# Altium schematic sheet Sheet1.SchDoc
size A3; SheetNumber: 1; SheetTotal: 2
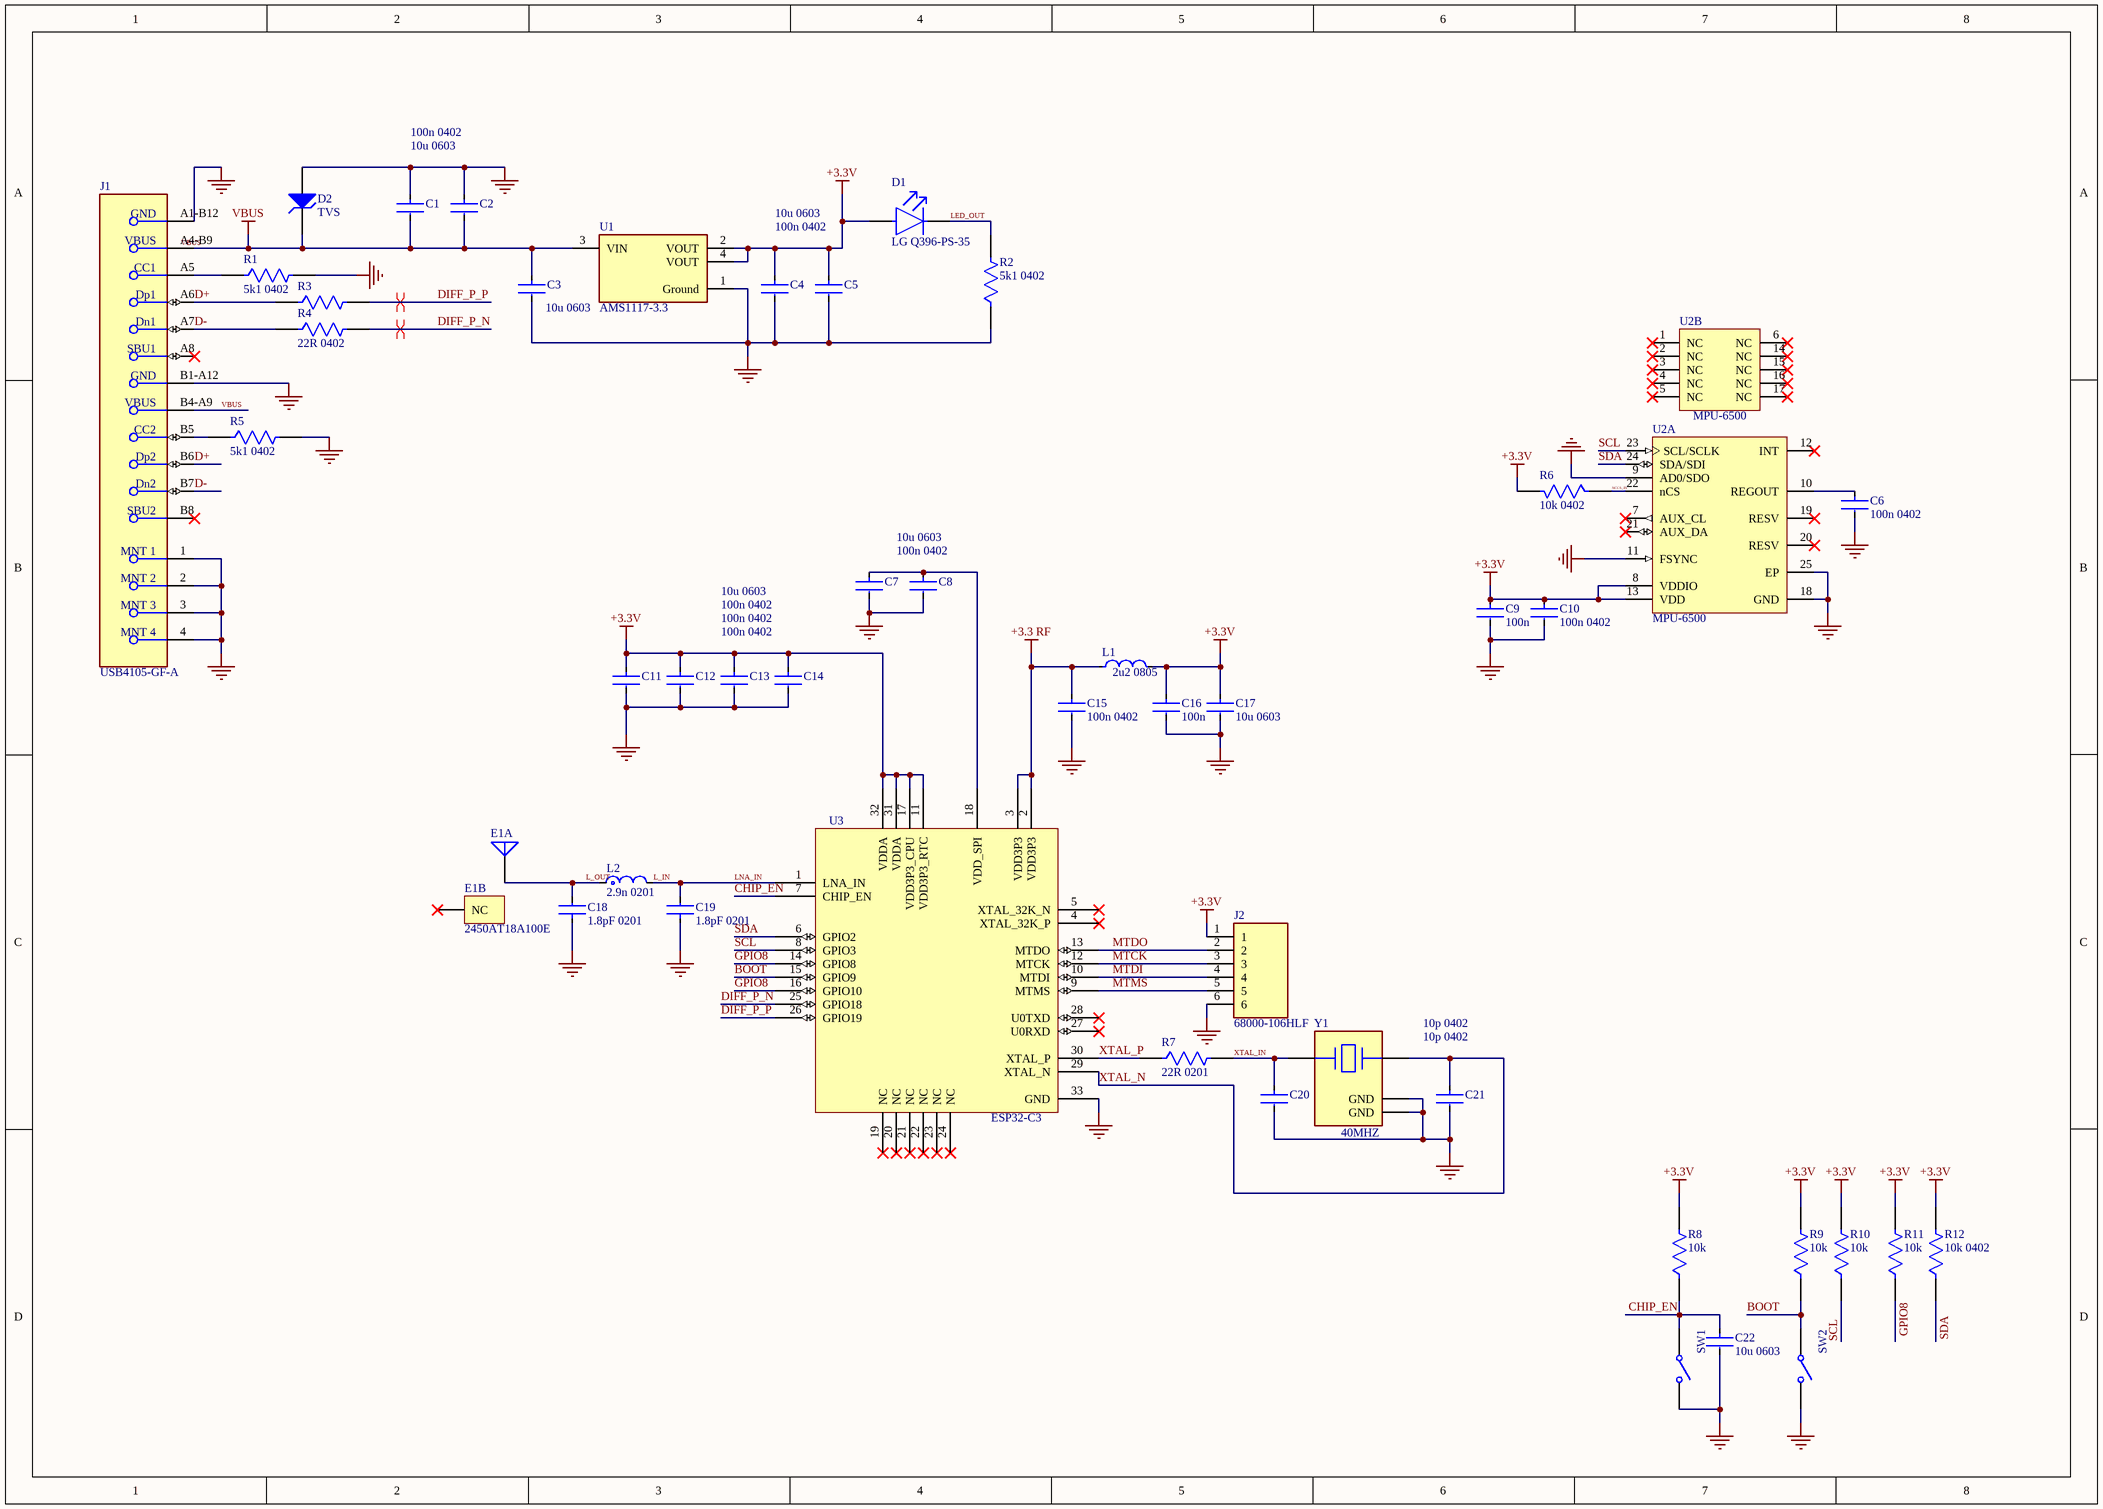
[diagram p0: Sheet1.SchDoc]

## Parts
C1  100n 0402  [FP-0402B104K500CT-IPC_C]
C2  10u 0603  [FP-GRM188-0_15-IPC_C]
C3  10u 0603  [FP-GRM188-0_15-IPC_C]
C4  10u 0603  [FP-GRM188-0_15-IPC_C]
C5  100n 0402  [FP-0402B104K500CT-IPC_C]
C6  100n 0402  [FP-0402B104K500CT-IPC_C]
C7  10u 0603  [FP-GRM188-0_15-IPC_C]
C8  100n 0402  [FP-0402B104K500CT-IPC_C]
C9  100n  [FP-0402B104K500CT-IPC_C]
C10  100n 0402  [FP-0402B104K500CT-IPC_C]
C11  10u 0603  [FP-GRM188-0_15-IPC_C]
C12  100n 0402  [FP-0402B104K500CT-IPC_C]
C13  100n 0402  [FP-0402B104K500CT-IPC_C]
C14  100n 0402  [FP-0402B104K500CT-IPC_C]
C15  100n 0402  [FP-0402B104K500CT-IPC_C]
C16  100n  [FP-0402B104K500CT-IPC_C]
C17  10u 0603  [FP-GRM188-0_15-IPC_C]
C18  1.8pF 0201  [FP-GRM033-0_03-IPC_B]
C19  1.8pF 0201  [FP-GRM033-0_03-IPC_B]
C20  10p 0402  [FP-C0402-BB-MFG]
C21  10p 0402  [FP-C0402-BB-MFG]
C22  10u 0603  [FP-GRM188-0_15-IPC_C]
D1  LG Q396-PS-35  [FP-LG_Q396-MFG]
D2  TVS  [ONSC-SOD-523-2-502-01_V]
E1  2450AT18A100E  [JT-2450AT18A100-2_V]  (value not drawn)  (parts A,B of 2)
J1  USB4105-GF-A  [FP-USB4105-GF-A-MFG]
J2  68000-106HLF  [HDRV6W64P0X254_1X6_1524X254X839P]
L1  2u2 0805  [FP-MLZ2012-0_85-IPC_B]
L2  2.9n 0201  [FP-LQP03TG_02-IPC_B]
R1  5k1 0402  [FP-RN73R1E-IPC_C]
R2  5k1 0402  [FP-RN73R1E-IPC_C]
R3  22R 0402  [FP-MCR01-IPC_C]  (value not drawn)
R4  22R 0402  [FP-MCR01-IPC_C]
R5  5k1 0402  [FP-RN73R1E-IPC_C]
R6  10k 0402  [FP-MCS0402-IPC_C]
R7  22R 0201  [FP-AF0201-IPC_A]
R8  10k  [FP-MCS0402-IPC_C]
R9  10k  [FP-MCS0402-IPC_C]
R10  10k  [FP-MCS0402-IPC_C]
R11  10k  [FP-MCS0402-IPC_C]
R12  10k 0402  [FP-MCS0402-IPC_C]
SW1  434121025816  [434121025816]  (value not drawn)
SW2  434121025816  [434121025816]  (value not drawn)
U1  AMS1117-3.3  [FP-AMS1117-IPC_C]
U2  MPU-6500  [INSE-MPU-6500-QFN24_M]  (parts A,B of 2)
U3  ESP32-C3  [ESP32-C3 - duplicate2]
Y1  40MHZ  [FP-ABM3B-MFG]

## Nets
+3.3 RF: C15.1 L1.1 U3.2(VDD3P3) U3.3(VDD3P3)
+3.3V: C4.1 C5.1 C9.1 C10.1 C11.1 C12.1 C13.1 C14.1 C16.1 C17.1 D1.2(A) J2.1 L1.2 R6.2 R8.2 R9.2 R10.2 R11.2 R12.2 U1.2(VOUT) U1.4(VOUT) U2.8(VDDIO) U2.13(VDD) U3.11(VDD3P3_RTC) U3.17(VDD3P3_CPU) U3.31(VDDA) U3.32(VDDA)
GND: C1.1 C2.1 C3.2 C4.2 C5.2 C6.2 C7.2 C8.2 C9.2 C10.2 C11.2 C12.2 C13.2 C14.2 C15.2 C16.2 C17.2 C18.1 C19.1 C20.2 C21.2 C22.2 D2.2(A) J1.1(MNT_1) J1.2(MNT_2) J1.3(MNT_3) J1.4(MNT_4) J1.A1-B12(GND) J1.B1-A12(GND) J2.6 R1.2 R2.1 R5.2 SW1.2 SW2.2 U1.1(Ground) U2.9(AD0/SDO) U2.11(FSYNC) U2.18(GND) U2.25(EP) U3.33(GND) Y1.2(GND) Y1.4(GND)
VBUS: C1.2 C2.2 C3.1 D2.1(K) J1.A4-B9(VBUS) J1.B4-A9(VBUS) U1.3(VIN)
BOOT: R9.1 SW2.1 U3.15(GPIO9)
CHIP_EN: C22.1 R8.1 SW1.1 U3.7(CHIP_EN)
D+: J1.A6(Dp1) J1.B6(Dp2) R3.1
D-: J1.A7(Dn1) J1.B7(Dn2) R4.1
DIFF_P_N: R4.2 U3.25(GPIO18)
DIFF_P_P: R3.2 U3.26(GPIO19)
GPIO8: R11.1 U3.14(GPIO8) U3.16(GPIO10)
L_IN: C19.2 L2.2 U3.1(LNA_IN)  [also labelled LNA_IN]
L_OUT: C18.2 E1.1(FP) L2.1
LED_OUT: D1.1(C) R2.2
MTCK: J2.3 U3.12(MTCK)
MTDI: J2.4 U3.10(MTDI)
MTDO: J2.2 U3.13(MTDO)
MTMS: J2.5 U3.9(MTMS)
NCCS_IN: R6.1 U2.22(nCS)
SCL: R10.1 U2.23(SCL/SCLK) U3.8(GPIO3)
SDA: R12.1 U2.24(SDA/SDI) U3.6(GPIO2)
XTAL_IN: C20.1 R7.2 Y1.1
XTAL_N: C21.1 U3.29(XTAL_N) Y1.3
XTAL_P: R7.1 U3.30(XTAL_P)
NetC6_1: C6.1 U2.10(REGOUT)
NetC7_1: C7.1 C8.1 U3.18(VDD_SPI)
NetJ1_A5: J1.A5(CC1) R1.1
NetJ1_B5: J1.B5(CC2) R5.1

Not connected (* = marked no-connect by the designer): E1 2(NC)*; J1 A8(SBU1)* B8(SBU2)*; U2 1(NC)* 2(NC)* 3(NC)* 4(NC)* 5(NC)* 6(NC)* 7(AUX_CL)* 12(INT)* 14(NC)* 15(NC)* 16(NC)* 17(NC)* 19(RESV)* 20(RESV)* 21(AUX_DA)*; U3 4(XTAL_32K_P)* 5(XTAL_32K_N)* 19(NC)* 20(NC)* 21(NC)* 22(NC)* 23(NC)* 24(NC)* 27(U0RXD)* 28(U0TXD)*

## Layout directives
differential pair: DIFF_P_N, DIFF_P_P

## Notes on the sheet
- Labels drawn without touching a wire or pin: VBUS

## Library data of the parts
C1 C5 C6 C8-C10 C12-C16 = CMP-45632-000010-1: CAP CER 0.1UF 50V X7R 0402; Tolerance: 10%; Capacitance: 100nF; Max Operating Temperature: 125°C; Case Code (Metric): 1005; RoHS Compliant: Yes; Series: -; Case Code (Imperial): 0402; Voltage Rating: 50V; Min Operating Temperature: -55°C; Mount: Surface Mount; Case/Package: 0402; Packaging: Cut Tape
C2-C4 C7 C11 C17 C22 = CMP-06035-017494-1: Chip Multilayer Ceramic Capacitors for General Purpose, 0603, 10uF, X5R, 15%, 20%, 16V; Thickness: 0.037inch; Case/Package: 0603; Case Code (Metric): 1608; Voltage Rating: 16V; Tolerance: 20%; Min Operating Temperature: -55°C; Capacitance: 10uF; Length: 0.063inch; Case Code (Imperial): 0603; Packaging: Cut Tape; Lead Free: Lead Free; Material: Ceramic; Height: 0.8mm; Max Operating Temperature: 85°C; Mount: Surface Mount; Width: 0.031inch; Voltage Rating (DC): 16V
C18 C19 = CMP-2010-01087-2: Chip Multilayer Ceramic Capacitors for General Purpose, 0201, 1.8pF, C0G, 30ppm/°C, 0.1pF, 50V; Width: 0.012inch; Voltage Rating (DC): 50V; Max Operating Temperature: 125°C; Capacitance: 1.8pF; Min Operating Temperature: -55°C; Case Code (Imperial): 0201; Packaging: Tape and Reel; Termination: SMD/SMT; Voltage Rating: 50V; Case/Package: 0201; Case Code (Metric): 0603; Length: 0.6mm; Thickness: 0.013inch; Depth: 0.3mm; Package Quantity: 15000; Mount: Surface Mount; Height: 0.3mm; Dielectric: C0G
C20 C21 = CMP-03020-005426-2: CAP CER 10PF 16V NP0 0402; Manufacturer Part Number: C0402C100J4GAC7867; Manufacturer: Kemet; Temperature Characteristic: C0G; Temperature Coefficient: 15%; Tolerance: 0.05; Material: Ceramic; Octopart: https://octopart.com/c0402c100j4gac7867-kemet-1500972; Package: C0402-BB; Ipc Land Pattern Name: CAPC10050X50; Temperature Range Low: -55°C; ComponentLink2URL: https://content.kemet.com/datasheets/KEM_C1002_X7R_SMD.pdf; ComponentLink2Description: Datasheet; Device Class L2: Capacitors; Lead Free: Yes; Temperature Range High: +125°C; Device Class L1: Passive Components; Automotive: No; Category: Cap; Height: 0.55mm; Capacitance: 10 pF; Digikey Description: CAP CER 10PF 16V NP0 0402; Device Class L3: Ceramic Capacitors; Value: 10 pF; Voltage Rating: 16 V; Temperature: -55°C to +125°C; RoHS: TRUE
D1 = CMP-62016-000069-1: LED GREEN DIFFUSED 0603 SMD; Lens Color: White; Wavelength: 573nm; Test Current: 20mA; Luminous Intensity: 163mcd; Lens Style: Flat; Lens Size: 0.8mm; Forward Voltage: 2V; Viewing Angle: 120°; Height: 0.4mm; Color: Green; Mount: Surface Mount; Case Code (Metric): 1608; Lens Transparency: Diffused; REACH SVHC: No SVHC; Length: 1.6mm; Width: 0.8mm; Dominant Wavelength: 573nm; RoHS Compliant: Yes; Case/Package: 0603; Case Code (Imperial): 0603; Packaging: Tape and Reel; Forward Current: 20mA
D2 = CMP-1063-00102-1: Transient Voltage Suppressor, Micro-Packaged Diode for ESD Protection, 2-Pin SOD-523, Pb-Free, Tape and Reel; Manufacturer: On Semiconductor; PartNumber: ESD5Z5.0T1G; V(BR) Min (V): 6.2; VRWM Max (V): 5; Number of Lines: 1; PPK Max (W): 174; IR Max (uA): 0.05; Direction: Unidirectional; PackageVersion: Rev. E, 09/2010; Mounting Technology: Surface Mount; Packing: Tape and Reel; ComponentLink2URL: http://www.onsemi.cn/pub_link/Collateral/ESD5Z2.5T1-D.PDF; ComponentLink2Description: Datasheet; PackageReference: SOD-523-2-502-01; ComponentLink1Description: Manufacturer URL; ComponentLink3URL: http://www.onsemi.com/pub_link/Collateral/502-01.PDF; PackageDescription: 2-Pin SOD, Body 1.2 x 0.8 mm; ComponentLink3Description: Package Specification; ComponentLink1URL: http://www.onsemi.com/; RoHS: Pb-Free; DatasheetVersion: Rev. 10
E1 = CMP-2000-05167-1: Ceramic Antenna, 2.45 GHZ, 2 W, -40 to 125 degC, 2-Pin SMD, RoHS, Tape and Reel; Manufacturer: Johanson Technology; Maximum Frequency: 2500MHz; Typical Antenna Gain: 0.5dB; Minimum Frequency: 2400MHz; Manufacturer URL: https://www.johansontechnology.com/; Type: Ceramic; Datasheet Version: Rev. 1.3, 07/2014; Category: Antenna; Package: 2Case18-4; Datasheet URL: http://www.johansontechnology.com/datasheets/antennas/2450AT18A100.pdf
J1 = e7c17a616881a82b79941196b4bec10: CONN RCPT USB2.0 TYPEC 5A; Manufacturer: GCT; Voltage Rating: 20V; Is Female: yes; Current Rating: 5/6.25/1.25/0.25A; Number Of Contacts: 16; Conn Orientation: Right Angle; Device Class L1: Connectors; Category: Conn; Lead Free: Yes; RoHS: TRUE; Temperature Range High: +85°C; Digikey Description: CONN RCPT USB2.0 TYPEC 5A; Device Class L3: unset; ComponentLink2Description: Datasheet; Manufacturer Part Number: USB4105-GF-A; Package: 0; Usb Standard: USB 2.0; Device Class L2: USB Connectors; Automotive: No; Temperature Range Low: -40°C; Height: 3.46mm; Temperature: -40°C to +85°C; Contact Material: Gold,Nickel; ComponentLink2URL: https://gct.co/files/drawings/usb4105.pdf; Octopart: https://octopart.com/usb4105-gf-a-gct-106627878
J2 = 68000-106HLF: Headers & Wire Housings 6POS HDR 30AU; Manufacturer_Name: Amphenol; Geometry.Height: 8.39mm; Manufacturer_Part_Number: 68000-106HLF; Mouser Part Number: 649-68000-106HLF; Mouser Price/Stock: https://www.mouser.co.uk/ProductDetail/Amphenol-FCI/68000-106HLF?qs=osVJq4lsVJd8cfhpTPyS9w%3D%3D; Arrow Part Number: *; Arrow Price/Stock: *; Datasheet Link: https://cdn.amphenol-cs.com/media/wysiwyg/files/drawing/68000.pdf
L1 = CMP-08253-000223-1: Shielded Multilayer Inductor 2.2uH ±20% 800mA 156mΩ AEC-Q200 SMD 0805; Resistance: 0.156R; Test Frequency: 2MHz; Core Material: Ferrite; Saturation Current: 170mA; DC Resistance (DCR): 156mR; Weight: 0.000194oz; Current Rating: 800mA; Length: 0.079inch; Packaging: Tape and Reel; Package Quantity: 1; Mount: Surface Mount; Tolerance: 20%; Case Code (Metric): 2012; Height - Seated (Max): 0.041inch; RoHS Compliant: Yes; Min Operating Temperature: -55°C; Width: 1.25mm; Ratings: AEC-Q200; Max Operating Temperature: 125°C; Height: 0.85mm; Inductance: 2.2uH; Shielding: Shielded; Termination: SMD/SMT; Case Code (Imperial): 0805; Max DC Current: 800mA; Case/Package: 0805
L2 = CMP-06042-006549-1: Film type RF Inductor 2.9nH ±0.1nH 500mA 0.2Ω 0201 (0603); Shielding: Unshielded; Test Frequency: 500MHz; DC Resistance (DCR): 200mR; Self Resonant Frequency: 9.5GHz; Core Material: Non-Magnetic; Q Factor: 14; Mount: Surface Mount; Resistor Type: Thin Film; Case/Package: 0201; Max DC Current: 500mA; Packaging: Tape and Reel; Length: 0.024inch; Case Code (Metric): 0603; Depth: 0.33mm; Height: 0.3mm; Max Operating Temperature: 125°C; Case Code (Imperial): 0201; Current Rating: 500mA; Termination: SMD/SMT; Inductance: 2.9nH; Height - Seated (Max): 0.013inch; Min Operating Temperature: -55°C; Military Standard: Not; Package Quantity: 15000; Width: 0.012inch; Radiation Hardening: No; DC Current: 500mA
R1 R2 R5 = CMP-04015-008529-1: 5.1kΩ ±1% 0.063W, 1/16W Chip Resistor 0402 (1005 Metric) Moisture Resistant Thin Film
R3 R4 = CMP-08839-007719-1: Thick Film Chip Resistor, 0402, 22Ω, 1%, 100ppm/°C, 0.063W, 50V; Power Rating: 63mW; Temperature Coefficient: 100ppm/°C; Resistance: 22R; Case/Package: 0402; Mount: Surface Mount; Lead Free: Lead Free; Tolerance: 1%
R6 R8-R12 = CMP-2002-02447-2: RES SMD 1.2K OHM 1% 1/10W 0402; Temperature Coefficient: 25ppm/°C; Resistance: 10kR; Max Power Dissipation: 63mW; Tolerance: 0.1%; Height: 0.015inch; Composition: Thin Film; Width: 0.02inch; Max Operating Temperature: 125°C; Length: 0.039inch; Packaging: Tape and Reel; Contact Plating: Tin; Lead Free: Lead Free; Package Quantity: 10000; Depth: 0.5mm; Number of Terminations: 2; Military Standard: Not; Case/Package: 0402; Min Operating Temperature: -55°C
R7 = CMP-03412-043910-1: Anti-Sulfurated Chip Resistors Automotive Grade 22Ω 5% 200ppm/°C 0201; Max Power Dissipation: 50mW; Voltage Rating: 25V; Number of Terminations: 2; Tolerance: 5%; Power Rating: 50mW; Packaging: Tape and Reel; Case/Package: 0201; Resistance: 22R; Height: 0.23mm; Resistor Type: Thick Film; Temperature Coefficient: 200ppm/°C; Case Code (Imperial): 0201; Series: AF; Width: 0.3mm; Min Operating Temperature: -55°C; Max Operating Temperature: 125°C; Features: Moisture Resistant; Termination: SMD/SMT; Lead Free: Lead Free; RoHS Compliant: Yes; Package Quantity: 10000; Weight: 6E-06oz; Case Code (Metric): 0603; Length: 0.6mm
SW1 SW2 = CMP-1459-00004-5: Switch Tactile Spst-no 0.05A 12V; Switch Travel: 250µm; Illumination Type: Illuminated, Non-Illuminated; Current Rating: 50mA; Contact Resistance: 100mΩ; Throw Configuration: SPST; Actuator Length: 800µm; Operating Force: 1.56N; Switch Function: Off-Mom; Mechanical Life: 50kcycles; Actuator Material: Liquid Crystal Polymer, Polymer; Height: 2.5mm; Termination: SMD/SMT; Contact Material: Stainless Steel, Steel; Contact Current Rating: 50mA; RoHS: Compliant; Min Operating Temperature: -40°C; REACH SVHC: No; Max Operating Temperature: 85°C; Lead Free: Lead Free; Color: Black; Mount: Surface Mount; Insulation Resistance: 100MΩ; Length: 7.3mm; Voltage Rating: 12V; Contact Plating: Silver; Packaging: Tape and Reel
U1 = CMP-209535-000001-1: LDO Voltage Regulators 1A, 3.3V; Manufacturer: Advanced Monolithic Systems; Dropout Voltage: 1.1V; Output Type: Fixed; Nominal Supply Current: 5mA; Max Power Dissipation: 1.2W; Max Supply Voltage: 15V; Number Of Outputs: 1; Standoff Height: 0.64mm; Max Junction Temp: +125°C; Height: 1.8mm; Package: AMS1117; Device Class L2: Power Management ICs; ComponentLink2Description: Datasheet; ComponentLink2URL: http://www.advanced-monolithic.com/pdf/ds1117.pdf; Category: IC; RoHS: TRUE; Automotive: No; Device Class L1: Integrated Circuits (ICs); Output Current: 1A; Device Class L3: Voltage Regulators - Linear; Temperature: -40°C to +125°C; Output Voltage: 3.3V; Manufacturer Part Number: AMS1117-3.3; Temperature Range Low: -40°C; Octopart: https://octopart.com/ams1117-3.3-advanced+monolithic+systems-25899300; Lead Free: Yes; Ipc Land Pattern Name: SOT229P700X180-4; Temperature Range High: +125°C
U2 = CMP-2000-05154-1: 3-Axis Gyroscope and 3-Axis Accelerometer Motion Processing Unit with I2C and SPI, 1.71 to 3.45 V, -40 to 85 degC, 24-Pin QFN, RoHS, Tape and Reel; Manufacturer: InvenSense; Online Catalog: MPU-6500Series; Output Type: Digital; Sensor Type: GyroscopeandAccelerometer; Featured Product: InvenSense-MPU-6500Six-Axis(Gyro+Acceleromete)MEMSMotionTrackingDevices; Other Names: 1428-1011-6; Article Library: MCUsasSensorHubs; Series: -; Category: Sensors,Transducers; Dynamic Catalog: MPU-6500Series; Standard Package: 1; Manufacturer URL: http://www.invensense.com/; Family: Multifunction; Datasheet Version: Rev. 1.0, 09/2013; Datasheet URL: https://datasheet.ciiva.com/29175/mpu-6500-spec-29175093.pdf
U3 = ESP32-C3: RISC-V MCU with Wi-Fi and BLE; Manufacturer: Espressif Systems
Y1 = CMP-27762-009597-1: Crystal 19.44MHz ±10ppm 10pF SMD-4 5mm x 3.2mm; ESR (Equivalent Series Resistance): 50R; Capacitance: 0F; Frequency Tolerance: 10ppm; Min Operating Temperature: -10°C; Lead Free: Lead Free; RoHS Compliant: Yes; Frequency Stability: 10ppm; Package Quantity: 1000; Tolerance: 10ppm; Resistor Type: Ceramic; Packaging: Tape and Reel; Height: 0.043inch; Mount: Surface Mount; Termination: SMD/SMT; Max Operating Temperature: 60°C; Frequency: 19.44MHz; Operating Frequency: 19.44 MHz; Length: 0.197inch; Case/Package: SMD/SMT; Series: ABM3B; Load Capacitance: 10pF; Width: 3.2mm